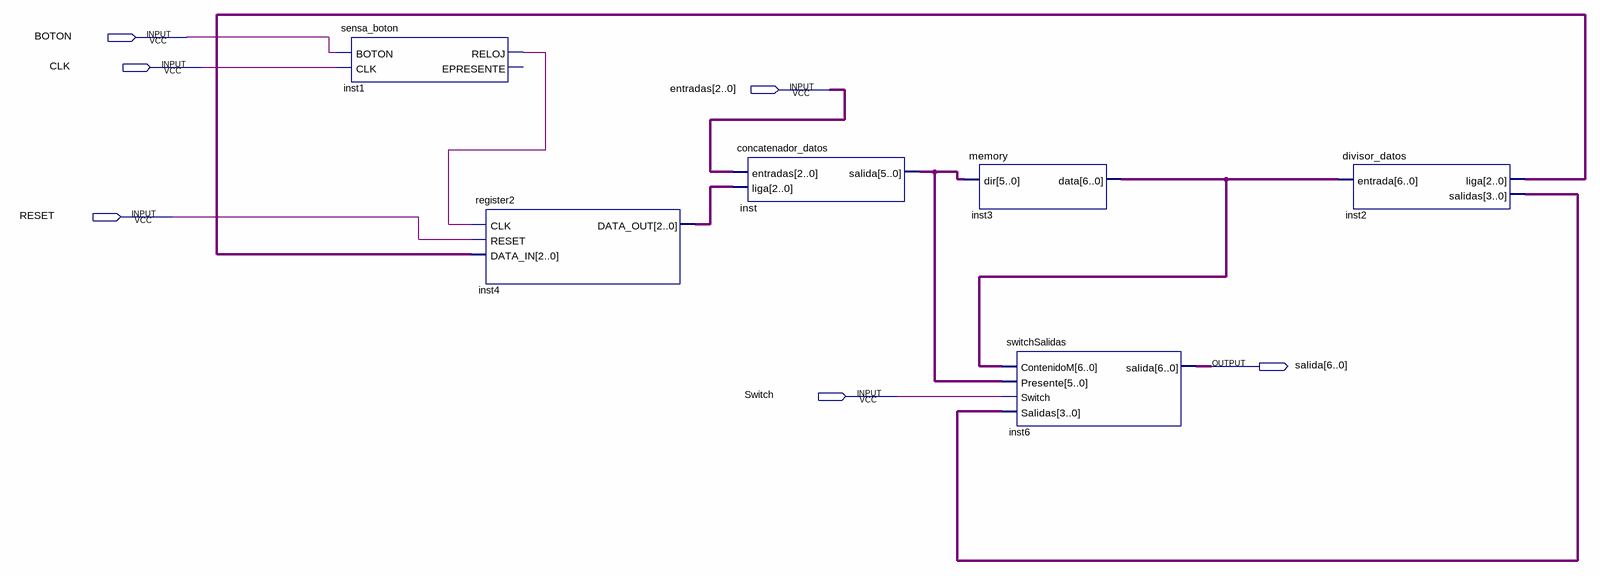
[diagram p0: schematic sheet]
// Quartus schematic Practica3.bdf as structural Verilog: 6 symbols, 6 pins
module Practica3 (
  input  BOTON,
  input  CLK,
  input  [2:0] entradas,
  input  RESET,
  input  Switch,
  output [6:0] salida
);

  wire inst1_reloj;
  wire [2:0] inst2_liga, inst4_data_out;
  wire [3:0] inst2_salidas;
  wire [5:0] inst_salida;
  wire [6:0] inst3_data;

  sensa_boton inst1 (.BOTON(BOTON), .CLK(CLK), .RELOJ(inst1_reloj));  // open: EPRESENTE
  register2 inst4 (.CLK(inst1_reloj), .RESET(RESET), .DATA_IN(inst2_liga), .DATA_OUT(inst4_data_out));
  concatenador_datos inst (.entradas(entradas), .liga(inst4_data_out), .salida(inst_salida));
  memory inst3 (.dir(inst_salida), .data(inst3_data));
  switchSalidas inst6 (
    .ContenidoM(inst3_data), .Presente(inst_salida), .Switch(Switch), .Salidas(inst2_salidas), .salida(salida));
  divisor_datos inst2 (.entrada(inst3_data), .liga(inst2_liga), .salidas(inst2_salidas));
endmodule
